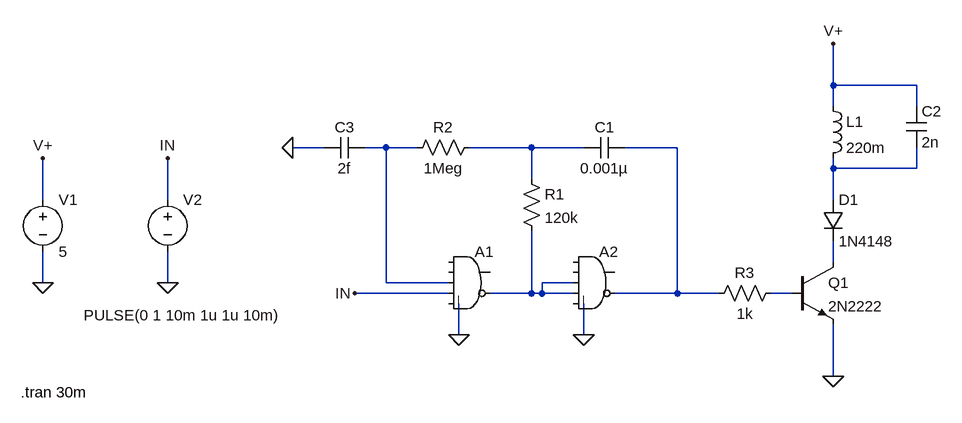
[diagram p0: schematic piezo_01.asc]
piezo_01.asc, the LTspice schematic file:
Version 4
SHEET 1 880 680
WIRE 688 -144 688 -208
WIRE 816 -144 688 -144
WIRE 688 -112 688 -144
WIRE 816 -112 816 -144
WIRE -96 -48 -144 -48
WIRE 0 -48 -32 -48
WIRE 48 -48 0 -48
WIRE 224 -48 128 -48
WIRE 304 -48 224 -48
WIRE 448 -48 368 -48
WIRE 688 -16 688 -32
WIRE 816 -16 816 -48
WIRE 816 -16 688 -16
WIRE 224 0 224 -48
WIRE -528 32 -528 -32
WIRE -336 32 -336 -32
WIRE 688 32 688 -16
WIRE 688 128 688 96
WIRE -528 160 -528 112
WIRE -336 160 -336 112
WIRE 0 160 0 -48
WIRE 96 160 0 160
WIRE 288 160 240 160
WIRE 96 176 -48 176
WIRE 224 176 224 80
WIRE 224 176 160 176
WIRE 240 176 240 160
WIRE 240 176 224 176
WIRE 288 176 240 176
WIRE 448 176 448 -48
WIRE 448 176 352 176
WIRE 512 176 448 176
WIRE 624 176 592 176
WIRE 112 240 112 192
WIRE 304 240 304 192
WIRE 688 304 688 224
FLAG 688 304 0
FLAG 688 -208 V+
FLAG -528 160 0
FLAG -528 -32 V+
FLAG -48 176 IN
FLAG -336 160 0
FLAG -336 -32 IN
FLAG 112 240 0
FLAG 304 240 0
FLAG -144 -48 0
SYMBOL Digital\\and 128 96 R0
SYMATTR InstName A1
SYMBOL Digital\\and 320 96 R0
SYMATTR InstName A2
SYMBOL res 208 -16 R0
SYMATTR InstName R1
SYMATTR Value 120k
SYMBOL cap 368 -64 R90
WINDOW 0 0 32 VBottom 2
WINDOW 3 32 32 VTop 2
SYMATTR InstName C1
SYMATTR Value 0.001µ
SYMBOL res 144 -64 R90
WINDOW 0 0 56 VBottom 2
WINDOW 3 32 56 VTop 2
SYMATTR InstName R2
SYMATTR Value 1Meg
SYMBOL res 608 160 R90
WINDOW 0 0 56 VBottom 2
WINDOW 3 32 56 VTop 2
SYMATTR InstName R3
SYMATTR Value 1k
SYMBOL cap 800 -112 R0
SYMATTR InstName C2
SYMATTR Value 2n
SYMBOL npn 624 128 R0
SYMATTR InstName Q1
SYMATTR Value 2N2222
SYMBOL voltage -528 16 R0
SYMATTR InstName V1
SYMATTR Value 5
SYMBOL voltage -336 16 R0
WINDOW 3 -129 194 Left 2
WINDOW 123 0 0 Left 0
WINDOW 39 0 0 Left 0
SYMATTR InstName V2
SYMATTR Value PULSE(0 1 10m 1u 1u 10m)
SYMBOL cap -32 -64 R90
WINDOW 0 0 32 VBottom 2
WINDOW 3 32 32 VTop 2
SYMATTR InstName C3
SYMATTR Value 2f
SYMBOL ind 672 -128 R0
SYMATTR InstName L1
SYMATTR Value 220m
SYMBOL diode 672 32 R0
SYMATTR InstName D1
SYMATTR Value 1N4148
TEXT -562 328 Left 2 !.tran 30m

The netlist it stands for:
* piezo_01.asc
A1 0 0 N001 IN 0 N006 0 0 AND
A2 0 0 N006 N006 0 N003 0 0 AND
R1 N002 N006 120k
C1 N003 N002 0.001µ
R2 N002 N001 1Meg
R3 N007 N003 1k
C2 V+ N004 2n
Q1 N005 N007 0 0 2N2222
V1 V+ 0 5
V2 IN 0 PULSE(0 1 10m 1u 1u 10m)
C3 N001 0 2f
L1 V+ N004 220m
D1 N004 N005 1N4148
.model D D
.lib standard.dio
.model NPN NPN
.model PNP PNP
.lib standard.bjt
.tran 30m
.backanno
.end